# Altium schematic sheet channel.SchDoc
size A3; SheetNumber: 2; SheetTotal: 3
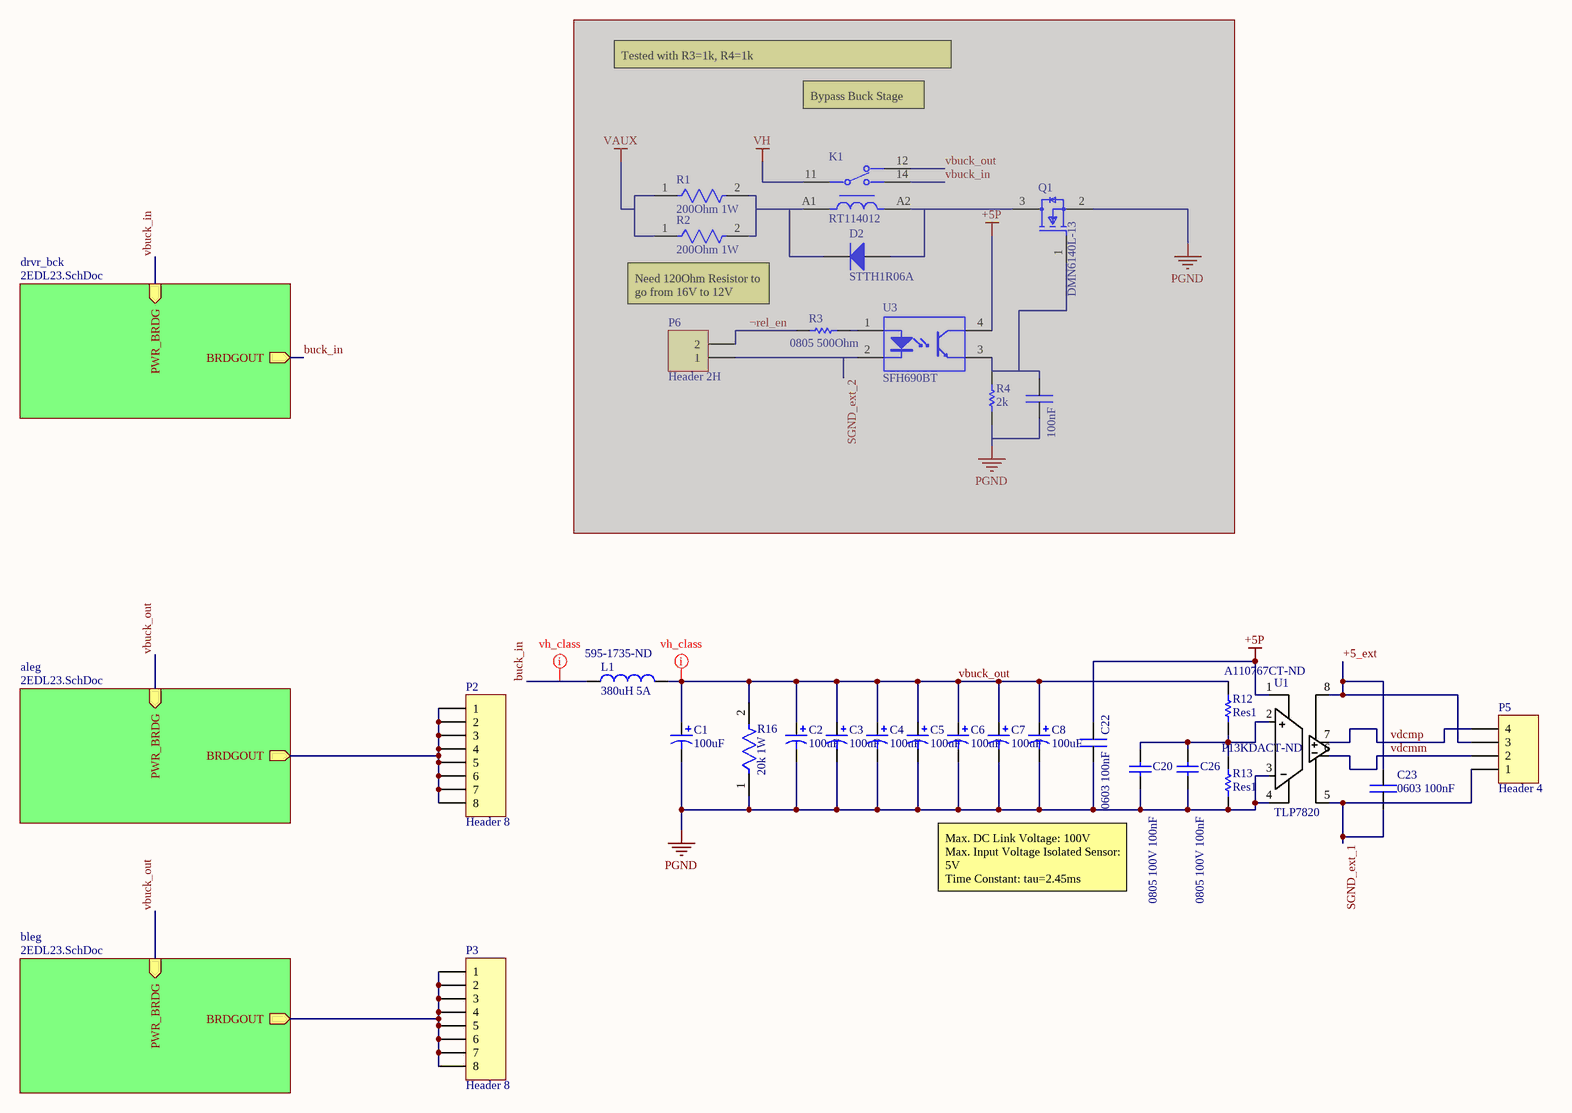
[diagram p0: channel.SchDoc]

## Parts
C1  100uF  [electrolyte_10mm_5mm]
C2  100uF  [electrolyte_10mm_5mm]
C3  100uF  [electrolyte_10mm_5mm]
C4  100uF  [electrolyte_10mm_5mm]
C5  100uF  [electrolyte_10mm_5mm]
C6  100uF  [electrolyte_10mm_5mm]
C7  100uF  [electrolyte_10mm_5mm]
C8  100uF  [electrolyte_10mm_5mm]
C19  100nF  [CAP 0603_1608]  (masked out: inside a compile mask, not in the netlist)
C20  0805 100V 100nF  [CAP 0805_2012]
C22  0603 100nF  [CAP 0603_1608]
C23  0603 100nF  [CAP 0603_1608]
C26  0805 100V 100nF  [CAP 0805_2012]
D2  STTH1R06A  [STM-STTH1R06A-SMA-2_V]  (masked out: inside a compile mask, not in the netlist)
K1  RT114012  [FP-RT114012-MFG]  (masked out: inside a compile mask, not in the netlist)
L1  380uH 5A  Supplier Part Number 1: 595-1735-ND  [inductor_HCTI-390-5.0]
P2  Header 8  [HEADER_4_2]
P3  Header 8  [HEADER_4_2]
P5  Header 4  [header_2_2_m]
P6  Header 2H  [header_2_1_m]  (masked out: inside a compile mask, not in the netlist)
Q1  DMN6140L-13  [FP-SOT23-MFG]  (masked out: inside a compile mask, not in the netlist)
R1  200Ohm 1W  [FP-CRCW2512-e3-MFG]  (masked out: inside a compile mask, not in the netlist)
R2  200Ohm 1W  [FP-CRCW2512-e3-MFG]  (masked out: inside a compile mask, not in the netlist)
R3  0805 500Ohm  [RES 0805_2012]  (masked out: inside a compile mask, not in the netlist)
R4  2k  [RES 0805_2012]  (masked out: inside a compile mask, not in the netlist)
R12  Res1  Supplier Part Number 1: A110767CT-ND  [RES 1206_3216]
R13  Res1  Supplier Part Number 1: P13KDACT-ND  [RES 1206_3216]
R16  20k 1W  [FP-CRCW2512-e3-IPC_C]
U1  TLP7820  [TLP7820]
U3  SFH690BT  [VISH-SOP-4_A_V]  (masked out: inside a compile mask, not in the netlist)

## Sub-sheets
aleg = 2EDL23.SchDoc: PWR_BRDG (in), BRDGOUT (out)
bleg = 2EDL23.SchDoc: PWR_BRDG (in), BRDGOUT (out)
drvr_bck = 2EDL23.SchDoc: PWR_BRDG (in), BRDGOUT (out)

## Nets
+5P: C22.1 U1.1
PGND: C1.2 C2.2 C3.2 C4.2 C5.2 C6.2 C7.2 C8.2 C20.1 C22.2 C26.1 R13.1 R16.1 U1.3 U1.4
+5_ext: C23.2 P5.3 U1.8
buck_in: L1.1 ; sheet drvr_bck/BRDGOUT
SGND_ext_1: C23.1 P5.1 U1.5
vbuck_in: sheet drvr_bck/PWR_BRDG
vbuck_out: C1.1 C2.1 C3.1 C4.1 C5.1 C6.1 C7.1 C8.1 L1.2 R12.2 R16.2 ; sheet aleg/PWR_BRDG, sheet bleg/PWR_BRDG
vdcmm: P5.2 U1.6
vdcmp: P5.4 U1.7
NetC20_2: C20.2 C26.2 R12.1 R13.2 U1.2
NetP2_1: P2.1 P2.2 P2.3 P2.4 P2.5 P2.6 P2.7 P2.8 ; sheet aleg/BRDGOUT
NetP3_1: P3.1 P3.2 P3.3 P3.4 P3.5 P3.6 P3.7 P3.8 ; sheet bleg/BRDGOUT

## Layout directives
net class VH: buck_in, vbuck_out

## Notes on the sheet
- Tested with R3=1k, R4=1k
  Logic Pin Current should be around 3mA to 2mA.
- Bypass Buck Stage
- Need 120Ohm Resistor to go from 16V to 12V
- Max. DC Link Voltage: 100V
  Max. Input Voltage Isolated Sensor: 5V
  Time Constant: tau=2.45ms
- 1
- 2
- 3
- 4
- 5
- 6
- 7
- 8
- A
- B
- C
- D
- Project:
- Date:
- Drawing number:
- Rev:
- Format:
- A3
- Drawn by:
- Laboratory:
- Page
- Sheet:
- of
- File:

## Library data of the parts
C1-C8 = Cap Pol1: Polarized Capacitor (Radial); Published: 8-Jun-2000; LatestRevisionDate: 17-Jul-2002; LatestRevisionNote: Re-released for DXP Platform.; PackageReference: RB7.6-15; Publisher: Altium Limited; PackageDescription: Polarized Capacitor (Radial); 2 Leads; Supplier 1: Digi-Key; Supplier Part Number 1: P124237-ND
C19 C22 C23 = cap_smd
  C22 C23: Supplier 1: Digi-Key; Supplier Part Number 1: 445-5666-1-ND
C20 C26 = Cap: Capacitor; Value: 100pF; Published: 8-Jun-2000; LatestRevisionDate: 17-Jul-2002; LatestRevisionNote: Re-released for DXP Platform.; PackageReference: RAD-0.3; Publisher: Altium Limited; PackageDescription: Radial Cap, Thru-Hole; 2 Leads; 0.3 in Pin Spacing; Supplier 1: Digi-Key; Supplier Part Number 1: 478-5028-1-ND
D2 = CMP-0738-00001-1: Turbo 2 Ultrafast High Voltage Rectifier, 600 V, 1 A, 2-Pin SMA Package, Pb-Free, RoHS, Tape and Reel; Manufacturer: STMicroelectronics; Trr (max): 25 ns; VF (typ): 1 V; Tj: 175 degC; IR (max): 75 uA; IF (AV): 1 A; IF (RMS): 7 A; VRRM: 600 V; RoHS: TRUE; ComponentLink2Description: Datasheet; Packing: Tape and Reel; ComponentLink1URL: http://www.st.com/; ComponentLink3Description: Package Specification; ComponentLink1Description: Manufacturer URL; PackageDescription: 2-Pin SMD, Body 4.275 x 2.575 mm, Height 2.65 mm; PackageVersion: Rev. 5; ComponentLink2URL: http://www.st.com/st-web-ui/static/active/en/resource/technical/document/datasheet/CD00005135.pdf; Mounting Technology: Surface Mount; PartNumber: STTH1R06A; DatasheetVersion: Rev. 5; ComponentLink3URL: http://www.st.com/st-web-ui/static/active/en/resource/technical/document/datasheet/CD00005135.pdf; PackageReference: STTH1R06A-SMA-2
K1 = CMP-03395-000068-1: RELAY GEN PURPOSE SPDT 12A 12V; Manufacturer: TE Connectivity; Coil Power: 400mW; Coil Resistance: 360Ω; Coil Type: Non-Latching; Number Of Contacts: 1; Height: 15.7mm; Throw Configuration: SPDT; Mouser Description: General Purpose Relays RT114012; Device Class L1: Electromechanical; ComponentLink2URL: https://www.te.com/commerce/DocumentDelivery/DDEController?Action=showdoc&DocId=Data+Sheet%7FRT1%7F0219%7Fpdf%7FEnglish%7FENG_DS_RT1_0219.pdf%7F1419108-1; Digikey Description: RELAY GEN PURPOSE SPDT 12A 12V; Package: RT114012; RoHS: TRUE; ComponentLink2Description: Datasheet; Octopart: https://octopart.com/rt114012-te+connectivity-39636422; Device Class L2: Relays; Manufacturer Part Number: RT114012; Ambient Temperature Range High: +85°C; Ambient Temperature Range Low: -40°C; Coil Voltage: 12V; Current Rating: 12A; Category: Relay; Lead Free: Yes; Device Class L3: Power Relays; Automotive: No
L1 = Inductor: Code_IEC: 1005; Value: 390uH; Published: 8-Jun-2000; LatestRevisionDate: 29-May-2009; LatestRevisionNote: IPC-7351 Footprint Added.; PackageReference: 0402-A; Publisher: Altium Limited; PackageDescription: Chip Inductor; Code_JEITA: 0402; Supplier 1: Digi-Key
P2 P3 = Header 8: Header, 8-Pin; LatestRevisionDate: 17-Jul-2002; LatestRevisionNote: Re-released for DXP Platform.; Publisher: Altium Limited
P5 = Header 4: Header, 4-Pin; LatestRevisionDate: 17-Jul-2002; LatestRevisionNote: Re-released for DXP Platform.; Publisher: Altium Limited
P6 = Header 2H: Header, 2-Pin, Right Angle; LatestRevisionDate: 17-Jul-2002; LatestRevisionNote: Re-released for DXP Platform.; Publisher: Altium Limited
Q1 = CMP-12801-000047-1: MOSFET N-CH 60V 1.6A SOT23; Manufacturer: Diodes Inc.; Turn Off Delay Time: 16.3ns; Power Dissipation: 0.7W; Pulse Drain Current: 10A; Number Of Channels: 1; Reverse Recovery Time: 16.8ns; Typ Forward Diode Voltage: 0.75V; Gate To Source Voltage: 20V; Rthja Max: 183°C/W; Gate Charge At Vgs: 8.6nC @ 10V; Drain To Source Resistance: 92mΩ; Depletion Mode: False; Max Junction Temp: +150°C; Max Forward Diode Voltage: 1V; Reverse Recovery Charge: 9nC; Input Capacitace At Vds: 315pF @ 40V; Standoff Height: 0.013mm; Threshold Vgs Max: 3V; Turn On Delay Time: 2.6ns; Mouser Description: MOSFET 31V to 99V N-Ch FET 60Vds 20Vgs 2.3A; ComponentLink2Description: Datasheet; Digikey Description: MOSFET N-CH 60V 1.6A SOT23; Lead Free: Yes; Category: Trans; Device Class L3: MOSFETs; Temperature Range High: +150°C; Octopart: https://octopart.com/dmn6140l-13-diodes+inc.-38898616; Drain To Source Voltage: 60V; ComponentLink2URL: https://www.diodes.com/assets/Datasheets/DMN6140L.pdf; Drain To Source Breakdown Voltage: 60V; Footprint Url: https://www.diodes.com/assets/Package-Files/SOT23.pdf; Package: SOT23; Continuous Drain Current: 1.6A; Device Class L1: Discrete Semiconductors; Device Class L2: Transistors; Number Of N Channels: 1; Temperature Range Low: -55°C; Height: 1.1mm; Manufacturer Part Number: DMN6140L-13; RoHS: TRUE; Temperature: -55°C to +150°C; Threshold Vgs Min: 1V; Automotive: No
R1 R2 = CMP-02407-003477-1: RES Thick Film, 200Ω, 1%, 1W, 100ppm/°C, 2512; Voltage Rating (DC): 500V; Resistance: 200R; Width: 3.15mm; Tolerance: 1%; Length: 6.3mm; Contact Plating: Tin; Case Code (Metric): 6432; Military Standard: Not; Package Quantity: 10; Composition: Thick Film; Packaging: Tape and Reel; Lead Free: Lead Free; Features: Automotive AEC-Q200; Max Operating Temperature: 155°C; Max Power Dissipation: 1W; Case/Package: 2512; Case Code (Imperial): 2512; Termination: SMD/SMT; Min Operating Temperature: -55°C; Power Rating: 1W; Weight: 0.001429oz; Radiation Hardening: No; Height: 0.028inch; Voltage Rating: 500V; Number of Pins: 2; Depth: 3.15mm; Number of Terminations: 2; Temperature Coefficient: 100ppm/°C
R3 R4 R12 R13 = Res1: Resistor; Value: 1K; Published: 8-Jun-2000; LatestRevisionDate: 17-Jul-2002; LatestRevisionNote: Re-released for DXP Platform.; PackageReference: AXIAL-0.3; Publisher: Altium Limited; PackageDescription: Axial Device, Thru-Hole; 2 Leads; 0.3 in Pin Spacing
  R12 R13: Supplier 1: Digi-Key
R16 = CMP-02407-007498-1: RES Thick Film, 20kΩ, 1%, 1W, 100ppm/°C, 2512 / CRCW251220K0FKEG; Resistance: 20kR; Voltage Rating (DC): 500V; Height: 0.028inch; Contact Plating: Tin; Termination: SMD/SMT; Tolerance: 1%; Package Quantity: 10; Temperature Coefficient: 100ppm/°C; Depth: 3.15mm; Number of Terminations: 2; Features: Automotive AEC-Q200; Max Power Dissipation: 1W; Length: 6.3mm; Case Code (Imperial): 2512; Military Standard: Not; Packaging: Tape and Reel; Case Code (Metric): 6432; Power Rating: 1W; Max Operating Temperature: 155°C; Weight: 0.001429oz; Composition: Thick Film; Min Operating Temperature: -55°C; Width: 0.124inch; Number of Pins: 2; Voltage Rating: 500V; Radiation Hardening: No; Lead Free: Lead Free; Case/Package: 2512
U3 = CMP-2000-07046-1: Optocoupler Phototransistor Output, 6 V, 50 mA, -55 to 100 degC, 4-Pin SOIC, RoHS, Tape and Reel; Manufacturer: Vishay; Collector Current (DC): 0.1A; Input Type: DC; Collector-Emitter Voltage: 70V; Forward Current: 50mA; Isolation Voltage: 3750V; DELETED: Compliant; Collector-Emitter Saturation Voltage: 0.3V; Power Dissipation: 0.15W; Reverse Breakdown Voltage: 6V; Number of  Elements: 1; Forward Voltage: 1.4V; Rad Hardened: No; Current Transfer Ratio: 300%; Datasheet Version: Rev. 2.6, 11/2015; Manufacturer URL: http://www.vishay.com/; Output Type: DC; Package Reference: SOP-4; Operating Temperature Classification: Industrial; Mounting Technology: SurfaceMount; Mounting: SurfaceMount; Output Device: Transistor; Package Description: 4-Pin Small Outline Package Integrated Circuit, Body 4.575 x 4.42 mm, Pitch 2.54 mm; Package Type: SOP; Operating Temp Range: -55Cto100C; Packaging: TapeandReel; Collector Current (DC) (Max): 0.1A; Pin Count: 4; Datasheet URL: http://www.vishay.com/docs/83686/sfh690ab.pdf
U1 = TLP7820: Supplier 1: Digi-Key; Supplier Part Number 1: TLP7820(TLECT-ND